# Altium schematic sheet Components.SchDoc
size B; SheetNumber: 2; SheetTotal: 2
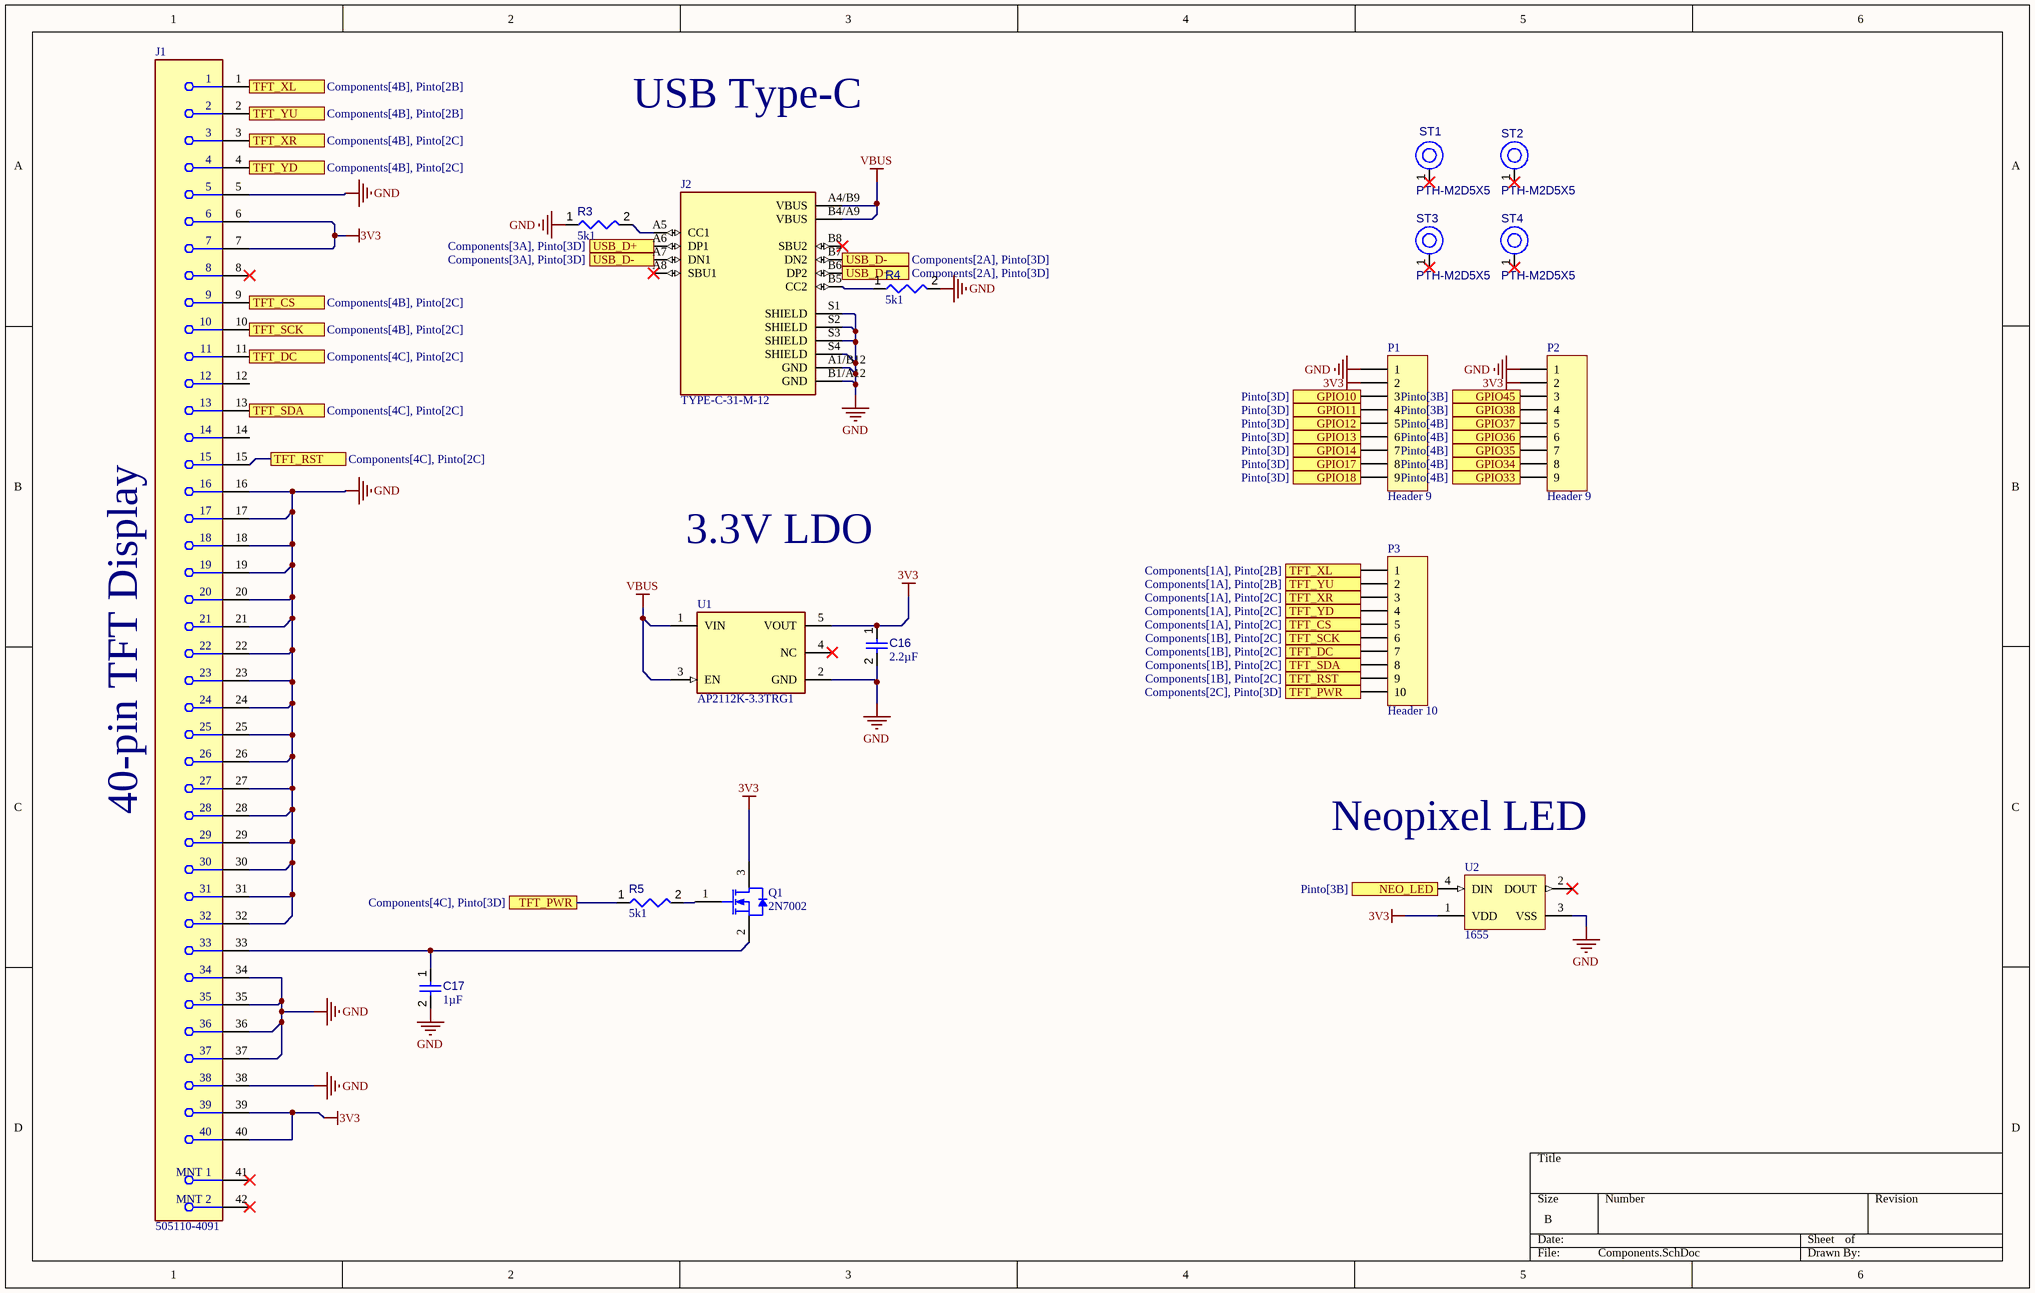
[diagram p0: Components.SchDoc]

## Parts
C16  value 2.2µF  [CAPC0402(1005)60_L]  (hidden comment: Capacitor 2,2µF +/-20% 10V 0402)
C17  value 1µF  [CAPC0402(1005)60_L]  (hidden comment: Capacitor 1µF +/-20% 10V 0402)
J1  505110-4091  [FP-505110-4091-MFG]
J2  TYPE-C-31-M-12  [HRO_TYPE-C-31-M-12]
P1  Header 9  [HDR1X9]
P2  Header 9  [HDR1X9]
P3  Header 10  [HDR1X10]
Q1  2N7002  [STM-SOT-23-3_V]
R3  value 5k1  [RESC0402(1005)_L]  (hidden comment: 0R2J)
R4  value 5k1  [RESC0402(1005)_L]  (hidden comment: 0R2J)
R5  value 5k1  [RESC0402(1005)_L]  (hidden comment: 0R2J)
ST1  PTH-M2D5X5  [PTH-M2D5X5]
ST2  PTH-M2D5X5  [PTH-M2D5X5]
ST3  PTH-M2D5X5  [PTH-M2D5X5]
ST4  PTH-M2D5X5  [PTH-M2D5X5]
U1  AP2112K-3.3TRG1  [FP-SOT25-IPC_A]
U2  1655  [ADA-RGB-1655_V]

## Ports
GPIO10 (see Pinto[3D]), GPIO11 (see Pinto[3D]), GPIO12 (see Pinto[3D]), GPIO13 (see Pinto[3D]), GPIO14 (see Pinto[3D]), GPIO17 (see Pinto[3D]), GPIO18 (see Pinto[3D]), GPIO33 (see Pinto[4B]), GPIO34 (see Pinto[4B]), GPIO35 (see Pinto[4B]), GPIO36 (see Pinto[4B]), GPIO37 (see Pinto[4B]), GPIO38 (see Pinto[3B]), GPIO45 (see Pinto[3B]), NEO_LED (see Pinto[3B]), TFT_CS (see Components[1A], Pinto[2C]), TFT_CS (see Components[4B], Pinto[2C]), TFT_DC (see Components[1B], Pinto[2C]), TFT_DC (see Components[4C], Pinto[2C]), TFT_PWR (see Components[2C], Pinto[3D]), TFT_PWR (see Components[4C], Pinto[3D]), TFT_RST (see Components[1B], Pinto[2C]), TFT_RST (see Components[4C], Pinto[2C]), TFT_SCK (see Components[1B], Pinto[2C]), TFT_SCK (see Components[4B], Pinto[2C]), TFT_SDA (see Components[1B], Pinto[2C]), TFT_SDA (see Components[4C], Pinto[2C]), TFT_XL (see Components[1A], Pinto[2B]), TFT_XL (see Components[4B], Pinto[2B]), TFT_XR (see Components[1A], Pinto[2C]), TFT_XR (see Components[4B], Pinto[2C]), TFT_YD (see Components[1A], Pinto[2C]), TFT_YD (see Components[4B], Pinto[2C]), TFT_YU (see Components[1A], Pinto[2B]), TFT_YU (see Components[4B], Pinto[2B]), USB_D+ (see Components[2A], Pinto[3D]), USB_D+ (see Components[3A], Pinto[3D]), USB_D- (see Components[2A], Pinto[3D]), USB_D- (see Components[3A], Pinto[3D])

## Nets
3V3: C16.1 J1.6 J1.7 J1.39 J1.40 P1.2 P2.2 Q1.3(D) U1.5(VOUT) U2.1(VDD)
GND: C16.2 C17.2 J1.5 J1.16 J1.17 J1.18 J1.19 J1.20 J1.21 J1.22 J1.23 J1.24 J1.25 J1.26 J1.27 J1.28 J1.29 J1.30 J1.31 J1.32 J1.34 J1.35 J1.36 J1.37 J1.38 J2.A1/B12(GND) J2.B1/A12(GND) J2.S1(SHIELD) J2.S2(SHIELD) J2.S3(SHIELD) J2.S4(SHIELD) P1.1 P2.1 R3.1 R4.2 U1.2(GND) U2.3(VSS)
VBUS: J2.A4/B9(VBUS) J2.B4/A9(VBUS) U1.1(VIN) U1.3(EN)
GPIO10: P1.3 ; port GPIO10
GPIO11: P1.4 ; port GPIO11
GPIO12: P1.5 ; port GPIO12
GPIO13: P1.6 ; port GPIO13
GPIO14: P1.7 ; port GPIO14
GPIO17: P1.8 ; port GPIO17
GPIO18: P1.9 ; port GPIO18
GPIO33: P2.9 ; port GPIO33
GPIO34: P2.8 ; port GPIO34
GPIO35: P2.7 ; port GPIO35
GPIO36: P2.6 ; port GPIO36
GPIO37: P2.5 ; port GPIO37
GPIO38: P2.4 ; port GPIO38
GPIO45: P2.3 ; port GPIO45
NEO_LED: U2.4(DIN) ; port NEO_LED
TFT_CS: J1.9 P3.5 ; port TFT_CS
TFT_DC: J1.11 P3.7 ; port TFT_DC
TFT_PWR: P3.10 R5.1 ; port TFT_PWR
TFT_RST: J1.15 P3.9 ; port TFT_RST
TFT_SCK: J1.10 P3.6 ; port TFT_SCK
TFT_SDA: J1.13 P3.8 ; port TFT_SDA
TFT_XL: J1.1 P3.1 ; port TFT_XL
TFT_XR: J1.3 P3.3 ; port TFT_XR
TFT_YD: J1.4 P3.4 ; port TFT_YD
TFT_YU: J1.2 P3.2 ; port TFT_YU
USB_D+: J2.A6(DP1) J2.B6(DP2) ; port USB_D+
USB_D-: J2.A7(DN1) J2.B7(DN2) ; port USB_D-
NetC17_1: C17.1 J1.33 Q1.2(S)
NetJ2_A5: J2.A5(CC1) R3.2
NetJ2_B5: J2.B5(CC2) R4.1
NetQ1_1: Q1.1(G) R5.2

Not connected (* = marked no-connect by the designer): J1 8* 12 14 41(MNT_1)* 42(MNT_2)*; J2 A8(SBU1)* B8(SBU2)*; ST1 1(H1)*; ST2 1(H1)*; ST3 1(H1)*; ST4 1(H1)*; U1 4(NC)*; U2 2(DOUT)*

## Notes on the sheet
- USB Type-C
- 3.3V LDO
- 40-pin TFT Display
- (near U2) Neopixel LED

## Library data of the parts
C16 = CMP-001-00056-4: Chip Capacitor, 2,2µF +/-20%, 10V, 0402, Thickness 0.6 mm; Tolerance: 10%; Mounting Technology: SMT; Max Operating Temperature: 85°C; Case/Package: 0402; Pins: 2; Min Operating Temperature: -55°C; Voltage Rating: 10V
C17 = CMP-001-00063-3: Chip Capacitor, 1µF +/-20%, 10V, 0402, Thickness 0.6 mm; Tolerance: 10%; Mounting Technology: SMT; Max Operating Temperature: 85°C; Voltage Rating: 10V; Pins: 2; Case/Package: 0402; Min Operating Temperature: -55°C
J1 = CMP-04775-000011-1: CONN FFC/FPC BOTTOM 40P .5MM R/A; Actuator Material: Nylon; Mating Cycles: 25; Actuator Color: Black; Voltage Rating: 50V; Number of Circuits: 40; Current Rating: 500mA; Pitch: 0.5mm; Gender: Receptacle; Contact Plating: Gold; Number of Rows: 1; Number of Pins: 40; Termination: Solder; Packaging: Cut Tape; Max Operating Temperature: 105°C; Housing Color: Beige; Mount: Surface Mount; Halogen Free: Low Halogen; Flammability Rating: UL94 V-0; Series: Easy-On 505110; Min Operating Temperature: -40°C; Contact Material: Bronze; Housing Material: Polymer; Height: 1.9mm; Number of Contacts: 40; Number of Positions: 40; Orientation: Right Angle
J2 = CMP-005-000001-1: USB Connectors 24 Receptacle 1 8.94*7.3mm RoHS; MF: HRO Electronics Co., Ltd.; Source: TYPE-C-31-M-12.SchLib; SnapEDA_Link: https://www.snapeda.com/parts/TYPE-C-31-M-12/HRO+Electronics+Co.%252C+Ltd./view-part/?ref=snap; MP: TYPE-C-31-M-12; Design Item ID: TYPE-C-31-M-12; Value: *; Component Type: Standard; Price: None; Package: Package; Check_prices: https://www.snapeda.com/parts/TYPE-C-31-M-12/HRO+Electronics+Co.%252C+Ltd./view-part/?ref=eda; Availability: Not in stock; Pin Count: 16
P1 P2 = Header 9: Header, 9-Pin; LatestRevisionDate: 17-Jul-2002; LatestRevisionNote: Re-released for DXP Platform.; Publisher: Altium Limited
P3 = Header 10: Header, 10-Pin; LatestRevisionDate: 17-Jul-2002; LatestRevisionNote: Re-released for DXP Platform.; Publisher: Altium Limited
Q1 = CMP-0434-00001-1: N-channel 60 V, 1.8 Ohm, 0.35 A STripFET(TM) II Power MOSFET, SOT23; Manufacturer: STMicroelectronics; PartNumber: 2N7002; ComponentLink2Description: Datasheet; ComponentLink2URL: http://www.st.com/st-web-ui/static/active/en/resource/technical/document/datasheet/CD00005134.pdf; ComponentLink1Description: Manufacturer URL; ComponentLink1URL: http://www.st.com/; DatasheetVersion: Rev. 9, 11/2008; PackageReference: SOT-23; Mounting Technology: Surface Mount; PackageDescription: 3-Pin SOT23, 3.016 x 2.8 mm Body, 0.95 mm Pitch
R3-R5 = CMP-009-00062-2: Jumper 0402 (1005 Metric); Pins: 2; Mounting Technology: SMT; Case/Package: 0402
ST1-ST4 = CMP-00028-00004-2: M2 PTH (2.5mm), 5mm pad; Pins: 1
U1 = CMP-12756-000035-1: IC REG LINEAR 3.3V 600MA SOT25; Number of Regulators: 1; Output Type: Fixed; Polarity: Positive; Min Input Voltage: 2.5V; Max Input Voltage: 6V; Accuracy: 1.5%; Quiescent Current: 55uA; Dropout Voltage: 250mV; Min Operating Temperature: -40°C; Length: 3.1mm; Output Current: 600mA; Max Operating Temperature: 85°C; Package Quantity: 1; Output Voltage: 3.3V; Width: 1.7mm; Number of Outputs: 1; Packaging: Tape and Reel; Height: 1.3mm; Lead Free: Lead Free; Max Output Current: 600mA; Case/Package: SOT-23-5; Mount: Surface Mount; Number of Pins: 5
U2 = CMP-2000-05026-1: Intelligent Control LED Integrated Light Source, 3.5 to 5.3 V, -25 to 80 degC, 4-Pin SMD, RoHS, Tape and Reel; Manufacturer: Adafruit-Industries-LLC; Number of LEDs: 10; Configuration: Discrete; Utilized LED: WS2812(5050); Datasheet URL: http://datasheet.octopart.com/ADA1655-Adafruit-Industries-datasheet-32028139.pdf; Series: Neopixel; Interface: -; Package Description: 4-Pin Surface Mount Device, Body 5 x 5 mm; Color: Red,Green,Blue(RGB); Category: Optoelectronics; Controller Type: -; Package Reference: 1655; Manufacturer URL: https://www.adafruit.com/; Mounting Type: SurfaceMount; Datasheet Version: May-13; Size / Dimension: 5.00mmLx5.00mmW; Family: Addressable,Specialty